# EAGLE design iridium-by-262-breakout (EAGLE 9.2.2)
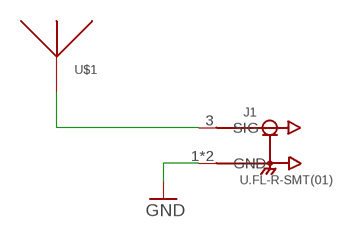
[diagram p0: schematic, sheet 1]

## Parts
J1  U.FL-R-SMT(01)  [HRS_U.FL-R-SMT(01)]
U$1  BY-IRIDIUM-254  [BY-IRIDIUM-254]

## Nets
GND: J1.1(GND) J1.2(GND)
N$1 [RF]: J1.3(SIG) U$1.P$1

## Library data of the parts
J1 = U.FL-R-SMT_01_:U.FL-R-SMT(01): U.FL Series 6 Ghz 50 Ohm Ultra-small SMT Coaxial Cable Receptacle; DESCRIPTION: U.FL Series 6 Ghz 50 Ohm Ultra-small SMT Coaxial Cable Receptacle; DIGI-KEY_PART_NUMBER: H9161-ND; DIGI-KEY_PURCHASE_URL: https://www.digikey.ru/product-detail/en/hirose-electric-co-ltd/U.FL-R-SMT_01_/H9161-ND/513010?utm_source=snapeda&utm_medium=aggregator&utm_campaign=symbol; MF: Hirose; MP: U.FL-R-SMT_01_; PACKAGE: None
U$1 = iridium-antenna:BY-IRIDIUM-254: Also known as APAE1621R2540ABDD1-T

## Net classes
2 RF: width 0.5 mm, drill 0.5 mm, clearance 0.065 mm

## Board
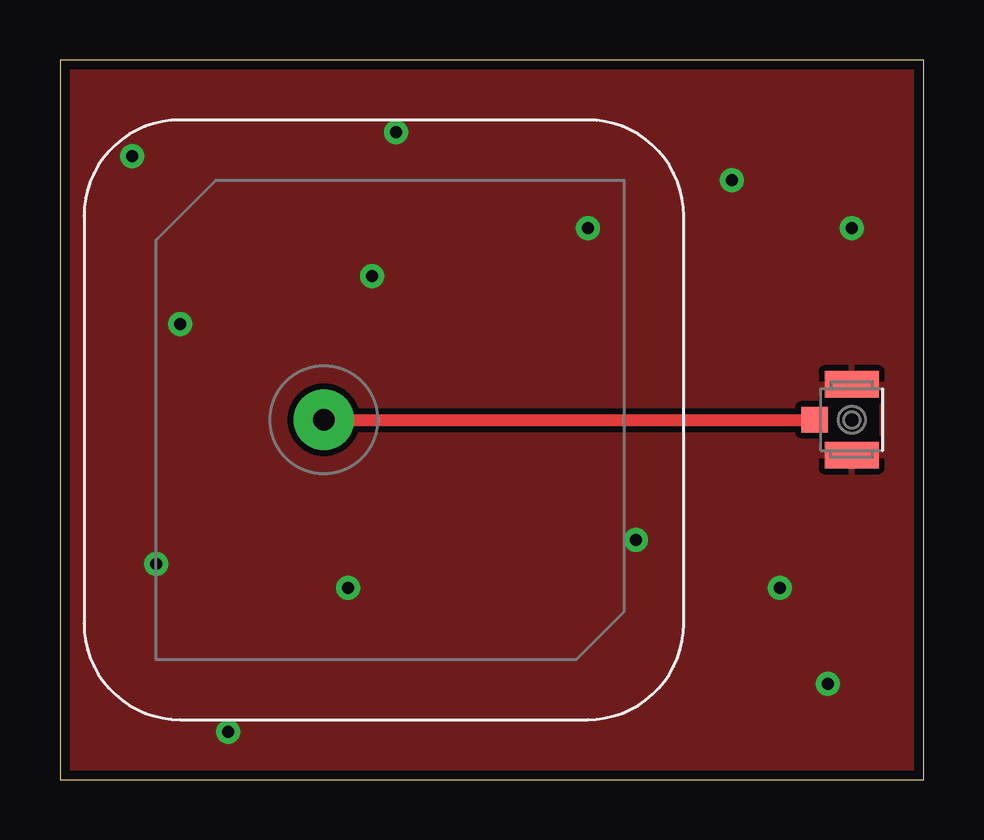
[diagram p1: board, top side]
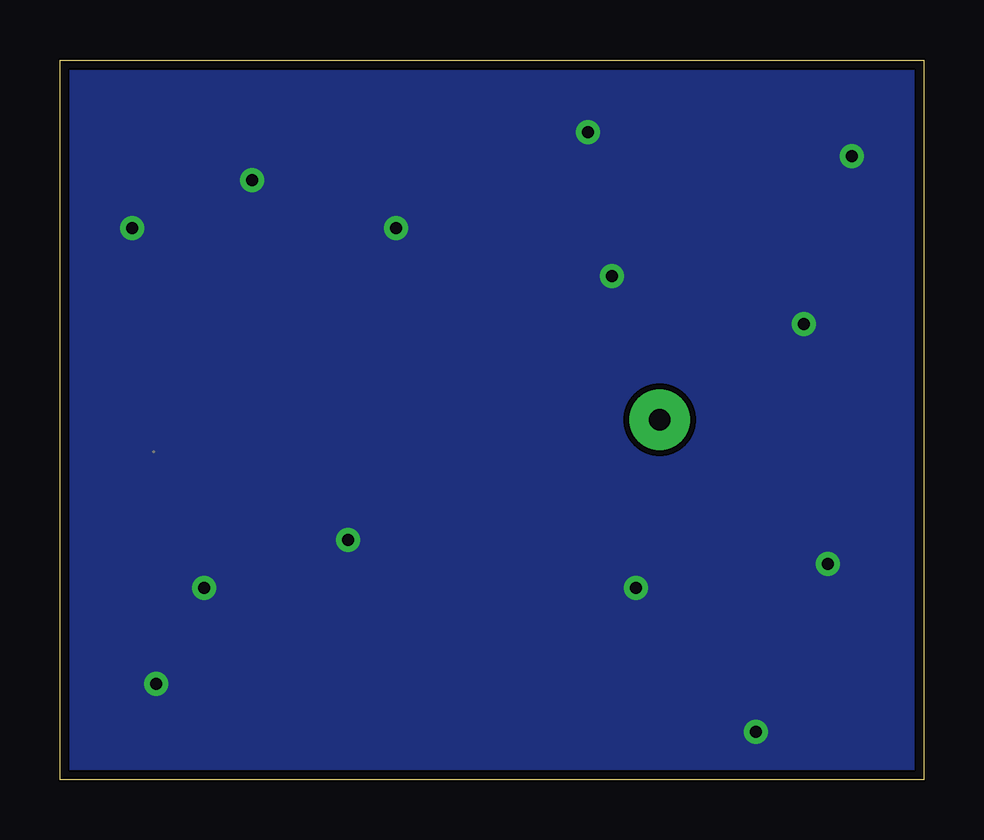
[diagram p2: board, bottom side, seen from below]

Size 36 x 30 mm. Coordinates in mm from the lower left corner, seen from the top.
Outline: 0,0 36,0 36,30 0,30 0,0
Copper layers (1*16): Top 0.035mm / dielectric 1mm / Bottom 0.035mm
Design rules "rezonit": minimum track width 0.2mm, minimum drill 0.5mm, track to track 0.25mm, track to pad 0.25mm, pad to pad 0.25mm, via to via 0.25mm, smd to smd 0.2mm, copper to edge 0.4mm, drill to drill 0.4mm, minimum pad ring 0.25mm, minimum via ring 0.25mm, stop-mask expansion 4mil, vias tented up to drill 0mil, thermal gap 10mil

### Footprints (pad centres in the part's own frame; a part is rotated, then mirrored left to right if it is on the bottom)
HRS_U.FL-R-SMT(01) = smd 1.1 x 2.25: 1 -1.475,0; 2 1.475,0 | smd 1.05 x 1.1: 3 0,-1.55
BY-IRIDIUM-254 = drill 0.9 pad 2.54: P$1 0,0

### Placement (x,y rotation side)
J1  33,15 270 top
U$1  11,15 90 top

### Tracks (layer width: path | path; a pad name or v marks a point on that pad's centre or on a via)
GND  (via drill 0.5)
  other vias: 28,25 13,21 22,23 12,8 24,10 4,9 5,19 3,26 14,27 30,8 32,4 33,23 7,2
  pour Top: 0,30 36,30 36,0 0,0
  pour Bottom: 0,30 36,30 36,0 0,0
N$1
  Top 0.5: U$1.P$1 J1.3